# EAGLE design Ten Element SMD (EAGLE 5.06)
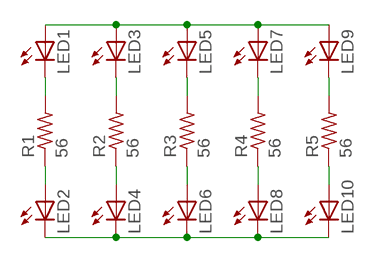
[diagram p0: schematic, sheet 1]

## Parts
LED1  LEDCHIPLED_1206  [CHIPLED_1206]
LED2  LEDCHIPLED_1206  [CHIPLED_1206]
LED3  LEDCHIPLED_1206  [CHIPLED_1206]
LED4  LEDCHIPLED_1206  [CHIPLED_1206]
LED5  LEDCHIPLED_1206  [CHIPLED_1206]
LED6  LEDCHIPLED_1206  [CHIPLED_1206]
LED7  LEDCHIPLED_1206  [CHIPLED_1206]
LED8  LEDCHIPLED_1206  [CHIPLED_1206]
LED9  LEDCHIPLED_1206  [CHIPLED_1206]
LED10  LEDCHIPLED_1206  [CHIPLED_1206]
R1  56  R-US_R1206  [R1206]
R2  56  R-US_R1206  [R1206]
R3  56  R-US_R1206  [R1206]
R4  56  R-US_R1206  [R1206]
R5  56  R-US_R1206  [R1206]

## Nets
N$1: LED1.C R1.2
N$2: LED2.A R1.1
N$3: LED3.C R2.2
N$4: LED4.A R2.1
N$5: LED5.C R3.2
N$6: LED6.A R3.1
N$7: LED7.C R4.2
N$8: LED9.C R5.2
N$9: LED8.A R4.1
N$10: LED10.A R5.1
N$11: LED1.A LED3.A LED5.A LED7.A LED9.A
N$12: LED2.C LED4.C LED6.C LED8.C LED10.C

## Library data of the parts
LED1-LED10 = led:LED: LED OSRAM: - CHIPLED LG R971, LG N971, LY N971, LG Q971, LY Q971, LO R971, LY R971 LH N974, LH R974 LS Q976, LO Q976, LY Q976 LO Q996 - Hyper CHIPLED LW Q18S LB Q993, LB Q99A, LB R99A - SideLED LS A670, LO A670, LY A670, LG A670, LP A670 LB A673, LV A673, LT A673, LW A673 LH A674 LY A675 LS A676, LA A676, LO A676, LY A676, LW A676 LS A679, LY A679, LG A679 - Hyper Micro SIDELED® LS Y876, LA Y876, LO Y876, LY Y876 LT Y87S - SmartLED LW L88C, LW L88S LB L89C, LB L89S, LG L890 LS L89K, LO L89K, LY L89K LS L896, LA L896, LO L896, LY L896 - TOPLED LS T670, LO T670, LY T670, LG T670, LP T670 LSG T670, LSP T670, LSY T670, LOP T670, LYG T670 LG T671, LOG T671, LSG T671 LB T673, LV T673, LT T673, LW T673 LH T674 LS T676, LA T676, LO T676, LY T676, LB T676, LH T676, LSB T676, LW T676 LB T67C, LV T67C, LT T67C, LS T67K, LO T67K, LY T67K, LW E67C LS E67B, LA E67B, LO E67B, LY E67B, LB E67C, LV E67C, LT E67C LW T67C LS T679, LY T679, LG T679 LS T770, LO T770, LY T770, LG T770, LP T770 LB T773, LV T773, LT T773, LW T773 LH T774 LS E675, LA E675, LY E675, LS T675 LS T776, LA T776, LO T776, LY T776, LB T776 LHGB T686 LT T68C, LB T68C - Hyper Mini TOPLED® LB M676 - Mini TOPLED Santana® LG M470 LS M47K, LO M47K, LY M47K Source: http://www.osram.convergy.de LUXEON: - LUMILED® LXK2-PW12-R00, LXK2-PW12-S00, LXK2-PW14-U00, LXK2-PW14-V00 LXK2-PM12-R00, LXK2-PM12-S00, LXK2-PM14-U00 LXK2-PE12-Q00, LXK2-PE12-R00, LXK2-PE12-S00, LXK2-PE14-T00, LXK2-PE14-U00 LXK2-PB12-K00, LXK2-PB12-L00, LXK2-PB12-M00, LXK2-PB14-N00, LXK2-PB14-P00, LXK2-PB14-Q00 LXK2-PR12-L00, LXK2-PR12-M00, LXK2-PR14-Q00, LXK2-PR14-R00 LXK2-PD12-Q00, LXK2-PD12-R00, LXK2-PD12-S00 LXK2-PH12-R00, LXK2-PH12-S00 LXK2-PL12-P00, LXK2-PL12-Q00, LXK2-PL12-R00 Source: www.luxeon.com KINGBRIGHT: KA-3528ASYC Source: www.kingbright.com
R1-R5 = rcl:R-US_: RESISTOR, American symbol

## Board
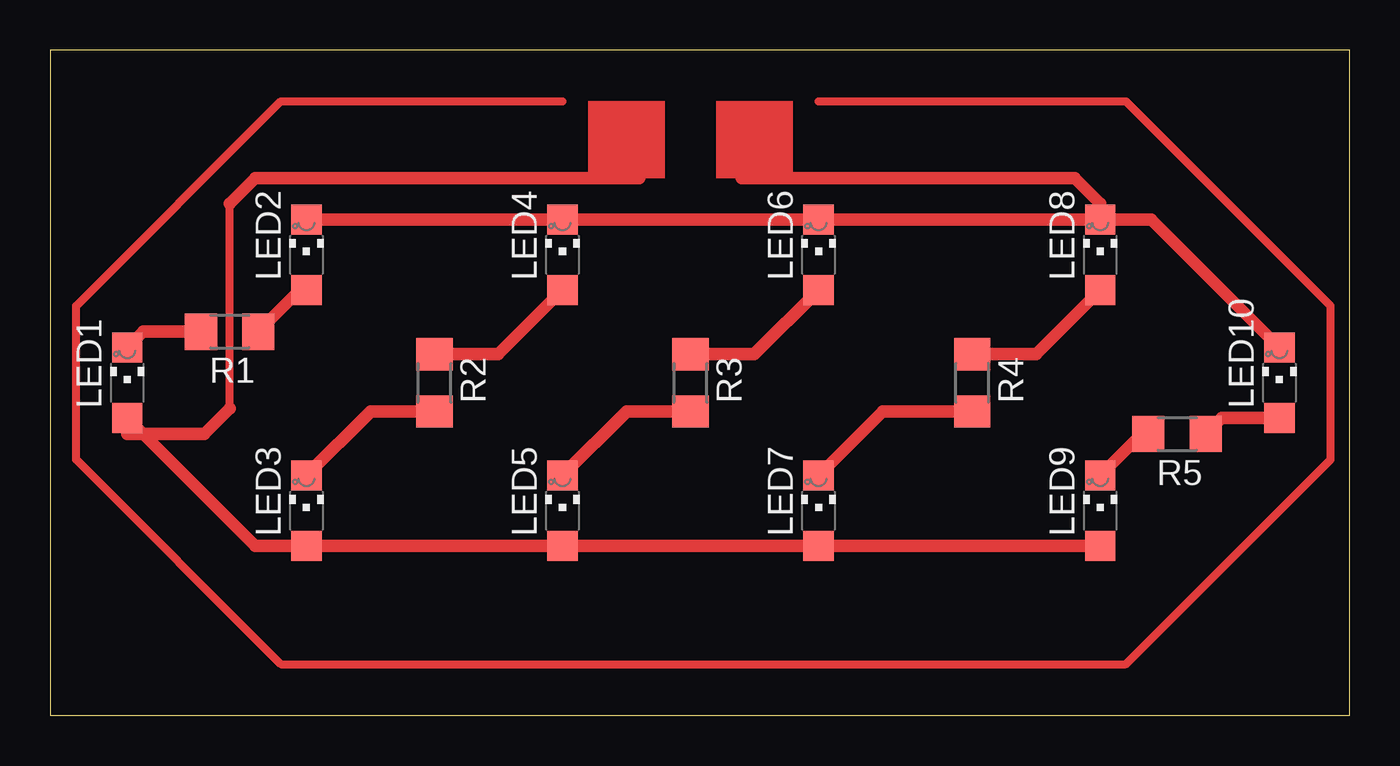
[diagram p1: board, top side]

Size 64.44 x 33.01 mm. Coordinates in mm from the lower left corner, seen from the top.
Outline: 0,0 64.44,0 64.44,33.01 0,33.01 0,0
Copper layers (1*16): Top 0.035mm / dielectric 1.5mm / Bottom 0.035mm
Design rules "default": minimum track width 10mil, minimum drill 24mil, track to track 8mil, track to pad 8mil, pad to pad 8mil, via to via 8mil, smd to smd 8mil, copper to edge 40mil, drill to drill 8mil, minimum pad ring 10mil, minimum via ring 8mil, stop-mask expansion 4mil, vias tented up to drill 0mil, thermal gap 10mil

### Footprints (pad centres in the part's own frame; a part is rotated, then mirrored left to right if it is on the bottom)
CHIPLED_1206 = smd 1.5 x 1.5: A 0,-1.75; C 0,1.75
R1206 = smd 1.6 x 1.803: 1 -1.422,0; 2 1.422,0

### Placement (x,y rotation side)
LED1  3.81,16.51 0 top
LED2  12.7,22.86 0 top
LED3  12.7,10.16 0 top
LED4  25.4,22.86 0 top
LED5  25.4,10.16 0 top
LED6  38.1,22.86 0 top
LED7  38.1,10.16 0 top
LED8  52.07,22.86 0 top
LED9  52.07,10.16 0 top
LED10  60.96,16.51 0 top
R1  8.89,19.05 180 top
R2  19.05,16.51 270 top
R3  31.75,16.51 270 top
R4  45.72,16.51 270 top
R5  55.88,13.97 180 top

### Tracks (layer width: path | path; a pad name or v marks a point on that pad's centre or on a via)
N$1
  Top 0.61: LED1.C 4.6,19.05 R1.2
N$2
  Top 0.61: R1.1 12.37,21.11 LED2.A
N$3
  Top 0.61: LED3.C 15.88,15.09 R2.2
N$4
  Top 0.61: LED4.A 22.22,17.93 R2.1
N$5
  Top 0.61: LED5.C 28.58,15.09 R3.2
N$6
  Top 0.61: LED6.A 34.92,17.93 R3.1
N$7
  Top 0.61: LED7.C 41.28,15.09 R4.2
N$8
  Top 0.61: LED9.C 54.13,13.97 R5.2
N$9
  Top 0.61: LED8.A 48.89,17.93 R4.1
N$10
  Top 0.61: R5.1 58.09,14.76 LED10.A
N$11
  Top 0.61: LED1.A 10.16,8.41 LED3.A LED5.A LED7.A LED9.A
N$12
  Top 0.61: LED10.C 54.61,24.61 LED8.C LED6.C LED4.C LED2.C
N$13
  Top 0.406: 25.4,30.48 11.43,30.48 1.27,20.32 1.27,12.7 11.43,2.54 53.34,2.54 63.5,12.7 63.5,20.32 53.34,30.48 38.1,30.48
N$14
  Top 0.61: 34.29,26.67 50.8,26.67 52.07,25.4
N$15
  Top 0.406: 8.89,15.24 8.89,25.4
  Top 0.61: 8.89,25.4 10.16,26.67 29.21,26.67 | 8.89,15.24 7.62,13.97 3.81,13.97
(copper drawn outside any net)
  shapes: Top area x3